# EasyEDA Pro project LeTian-robot2（轮腿机器人）.eprj, board Control-PCB
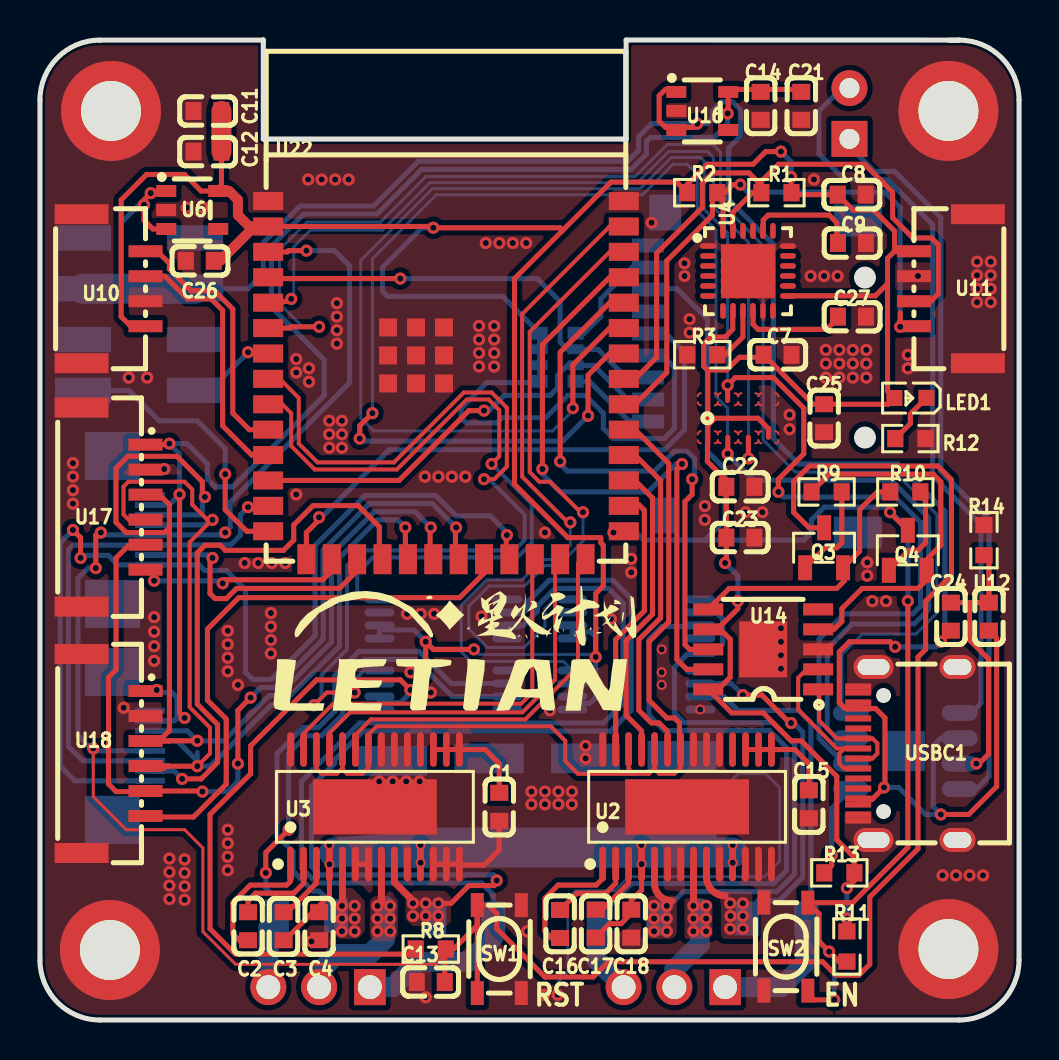
[diagram p4: board, top side]
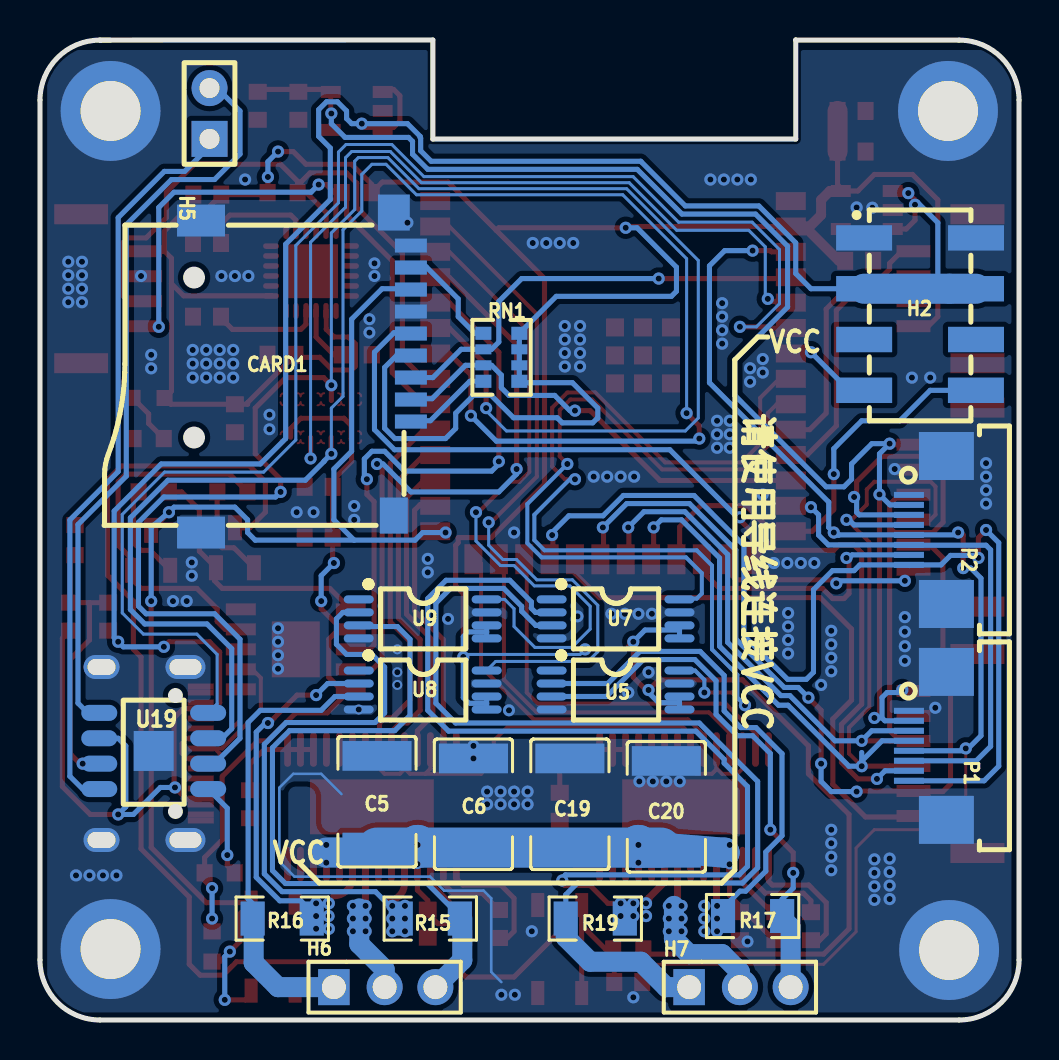
[diagram p5: board, bottom side, seen from below]

Outline 49 x 49.01 mm; copper layers: Top Layer, Bottom Layer. Coordinates in mm from the lower left corner of the outline.
Outline path: 46,49 29.34,49.01 29.34,44.05 11.18,44.05 11.18,49.01 11.17,49 3,49 arc(0.88,48.12) 0,46 0,3 arc(0.88,0.88) 3,0 46,0 arc(48.12,0.88) 49,3 49,46 arc(48.12,48.12) 46,49 ; 46,49 45.5,49
Stack: Top Layer 0.035mm / Dielectric1 1.51mm FR4 er 4.5 / Bottom Layer 0.035mm

## Design rules (mm)
spacing safeClearance (default): track to track 0.152, other pairs 0.05 to 0.3
track width trackWidth (default): min 0.127, default 0.254, max 2.54
differential pair differentialPair (default): width min 0.127, default 0.254, max 2.54; gap min 0.152, default 0.152
via viaSize (default): diameter min 0.3, default 0.61, max 10; hole min 0.2, default 0.305, max 6

## Placement (name value [footprint] x y rotation side)
C1  0.47uF  [C0603]  22.99 10.66 90 top
C2  10nF  [C0603]  10.41 4.69 270 top
C3  0.1uF  [C0603]  12.19 4.69 90 top
C4  0.1uF  [C0603]  13.97 4.69 90 top
C5  47uF  [C1812]  32.13 10.91 270 bottom
C6  47uF  [C1812]  27.31 10.79 270 bottom
C7  100nF  [C0603]  36.91 33.27 180 top
C8  100nF  [C0603]  40.62 41.27 180 top
C9  100nF  [C0603]  40.64 38.85 180 top
C11  0.1uF  [C0603]  8.38 45.46 180 top
C12  10uF  [C0603]  8.38 43.43 180 top
C13  0.1uF  [C0603]  19.56 1.9 0 top
C14  0.1uF  [C0603]  36.07 45.71 270 top
C15  0.47uF  [C0603]  38.48 10.79 90 top
C16  10nF  [C0603]  26.03 4.8 270 top
C17  0.1uF  [C0603]  27.81 4.82 90 top
C18  0.1uF  [C0603]  29.59 4.82 90 top
C19  47uF  [C1812]  22.48 10.79 270 bottom
C20  47uF  [C1812]  17.65 10.66 270 bottom
C21  10uF  [C0603]  38.1 45.71 270 top
C22  100nF  [C0603]  35.05 26.66 0 top
C23  1uF  [C0603]  35.05 24.12 0 top
C24  100nF  [C0603]  45.59 20.17 270 top
C25  100nF  [C0603]  39.24 30.09 270 top
C26  100nF  [C0603]  8 37.97 180 top
C27  100nF  [C0603]  40.64 35.17 180 top
CARD1  TF-15x15  [TF-SMD_TF-15-15]  35.69 32.38 0 bottom
H2  2.54-2*4P立贴针  [HDR-SMD_8P-P2.54-V-M-R2-C4-LS7.4]  4.95 35.3 270 bottom
H5  826629-2  [HDR-TH_2P-P2.54-V-M-1]  40.51 45.33 90 bottom
H6  2.54-1*3P针  [HDR-TH_3P-P2.54-V-M-1]  31.75 1.64 180 bottom
H7  2.54-1*3P针  [HDR-TH_3P-P2.54-V-M-1]  13.97 1.64 180 bottom
LED1  TLMS1100-GS08  [LED0603-RD_RED]  43.56 31.11 180 top
NOREF  -  [Pad_e5]  3.5 3.5 0 top
NOREF#2  -  [Pad_e2703]  3.56 45.46 0 top
NOREF#3  -  [Pad_e3]  45.47 3.55 0 top
NOREF#4  -  [Pad_e2704]  45.47 45.46 0 top
P1  FPC 0.5MM 8P 拉抽式 H2.0mm 下接  [FPC-SMD_8P-P0.50_LSXJ-H2.0-8P]  4.57 13.71 270 bottom
P2  FPC 0.5MM 8P 拉抽式 H2.0mm 下接  [FPC-SMD_8P-P0.50_LSXJ-H2.0-8P]  4.57 24.5 270 bottom
Q3  SS8050  [SOT-23-3_L2.9-W1.3-P1.90-LS2.4-BR]  39.24 23.61 270 top
Q4  SS8050  [SOT-23-3_L2.9-W1.3-P1.90-LS2.4-BR]  43.43 23.49 270 top
R1  10k  [R0603]  36.86 41.37 0 top
R2  10k  [R0603]  33.15 41.37 180 top
R3  10k  [R0603]  33.15 33.27 0 top
R8  10k  [R0603]  19.56 3.55 180 top
R9  10k  [R0603]  39.37 26.41 180 top
R10  10k  [R0603]  43.31 26.41 180 top
R11  10k  [R0603]  40.39 3.68 90 top
R12  1k  [R0603]  43.56 29.08 180 top
R13  1k  [R0603]  40 7.36 0 top
R14  0  [R0603]  47.24 24 90 top
R15  0Ω  [R1206]  29.46 5.07 0 bottom
R16  10mΩ  [R1206]  36.88 5.07 180 bottom
R17  10mΩ  [R1206]  13.34 5.2 0 bottom
R19  0Ω  [R1206]  21.21 5.07 180 bottom
RN1  1kΩ  [RES-ARRAY-SMD_0603-8P-L3.2-W1.6-BL]  25.91 33.14 270 bottom
SW1  -  [KEY-SMD_4P-L4.2-W3.2-P2.20-LS5.1-TL]  22.99 3.55 90 top
SW2  -  [KEY-SMD_4P-L4.2-W3.2-P2.20-LS5.1-TL]  37.33 3.67 90 top
U2  DRV8313PWPR  [HTSSOP-28_L9.8-W4.5-P0.65-LS6.6-BL-EP]  32.38 10.66 0 top
U3  DRV8313PWPR  [HTSSOP-28_L9.8-W4.5-P0.65-LS6.6-BL-EP]  16.76 10.66 0 top
U4  MPU6050  [QFN-24_L4.0-W4.0-P0.50-BL-EP2.7]  35.43 37.46 270 top
U5  INA240A3PWR  [TSSOP-8_L4.4-W3.0-P0.65-LS6.4-BL-2]  20.19 16.5 270 bottom
U6  SPX3819M5-L-3-3/TR  [SOT-23-5_L3.0-W1.7-P0.95-LS2.8-BR]  7.62 40.51 180 top
U7  INA240A3PWR  [TSSOP-8_L4.4-W3.0-P0.65-LS6.4-BL-2]  20.19 20.06 270 bottom
U8  INA240A3PWR  [TSSOP-8_L4.4-W3.0-P0.65-LS6.4-BL-2]  29.84 16.5 270 bottom
U9  INA240A3PWR  [TSSOP-8_L4.4-W3.0-P0.65-LS6.4-BL-2]  29.84 20.06 270 bottom
U10  GH1.25-4PWBPZ  [CONN-SMD_GH1.25-4PWBPZ]  3.68 36.57 90 top
U11  GH1.25-4PWBPZ  [CONN-SMD_GH1.25-4PWBPZ]  45.34 36.57 270 top
U12  10uF  [C0603]  47.49 20.17 270 top
U14  CH340K  [ESOP-10_L4.9-W3.9-P1.00-LS6.2-BL-EP]  36.19 18.53 90 top
U16  SPX3819M5-L-3-3/TR  [SOT-23-5_L3.0-W1.7-P0.95-LS2.8-BR]  33.15 45.46 180 top
U17  1.25-6PWTDK  [CONN-SMD_6P-P1.25_GH1.25-6PWBPZ]  3.68 25.65 270 top
U18  1.25-6PWTDK  [CONN-SMD_6P-P1.25_GH1.25-6PWBPZ]  3.68 13.33 270 top
U19  -  [NS4168-eSOP8]  43.31 13.45 0 bottom
U20  -  [MSM-MIC]  34.92 30.09 270 top
U22  ESP32-S3-WROOM-1-N8  [WIFIM-SMD_ESP32-S3-WROOM-1-N8]  20.32 32 0 top
USBC1  TYPE-C-31-M-12  [USB-C_SMD-TYPE-C-31-M-12]  43.43 13.33 90 top

## Footprints (pads in the part's own frame, mm; a bottom-side part is the same pattern mirrored in y, then rotated)
C0603
  rect 0.8x0.9 smd: 1(-0.7,0) 2(0.7,0)
C1812
  rect 1.486x3.457 smd: 1(-2.293,0) 2(2.293,0)
CONN-SMD_6P-P1.25_GH1.25-6PWBPZ
  rect 0.6x1.7 smd: 1(-3.125,1.6) 2(-1.875,1.6) 3(-0.625,1.6) 4(0.625,1.6) 5(1.875,1.6) 6(3.125,1.6)
  rect 1x2.7 smd: 7(-4.975,-1.6) 8(4.975,-1.6)
CONN-SMD_GH1.25-4PWBPZ
  rect 0.6x1.7 smd: 1(-1.875,-1.601) 2(-0.625,-1.601) 3(0.625,-1.601) 4(1.875,-1.601)
  rect 1x2.7 smd: 5(-3.725,1.601) 6(3.725,1.601)
ESOP-10_L4.9-W3.9-P1.00-LS6.2-BL-EP
  rect 0.6x1.5 smd: 1(-2,-2.75) 2(-1,-2.75) 3(0,-2.75) 4(1,-2.75) 5(2,-2.75) 6(2,2.75) 7(1,2.75) 8(0,2.75) 9(-1,2.75) 10(-2,2.75)
  rect 2.8x2.4 smd: 11(0,0)
FPC-SMD_8P-P0.50_LSXJ-H2.0-8P
  rect 0.3x1.5 smd: 1(-1.755,-0.938) 2(-1.255,-0.938) 3(-0.755,-0.938) 4(-0.255,-0.938) 5(0.244,-0.938) 6(0.745,-0.938) 7(1.244,-0.938) 8(1.745,-0.938)
  rect 2.4x2.75 smd: 9(3.7,0.938) 10(-3.7,0.938)
HDR-SMD_8P-P2.54-V-M-R2-C4-LS7.4
  rect 1.27x2.8 smd: 1(-3.81,-2.8) 2(-3.81,2.8) 3(-1.27,-2.8) 4(-1.27,2.8) 5(1.27,-2.8) 6(1.27,2.8) 7(3.81,-2.8) 8(3.81,2.794)
HDR-TH_2P-P2.54-V-M-1
  rect 1.8x1.8 hole 1: 1(-1.27,0)
  round 1.8 hole 1: 2(1.27,0)
HDR-TH_3P-P2.54-V-M-1
  rect 1.575x1.801 hole 1.199: 1(-2.54,0)
  round 1.801 hole 1.199: 2(0,0) 3(2.54,0)
HTSSOP-28_L9.8-W4.5-P0.65-LS6.6-BL-EP
  oval 0.343x1.732 smd: 1(-4.224,-2.865) 2(-3.574,-2.865) 3(-2.926,-2.865) 4(-2.276,-2.865) 5(-1.625,-2.865) 6(-0.976,-2.865) 7(-0.325,-2.865) 8(0.325,-2.865) 9(0.976,-2.865) 10(1.625,-2.865) 11(2.276,-2.865) 12(2.926,-2.865) 13(3.576,-2.865) 14(4.224,-2.865) 15(4.224,2.865) 16(3.576,2.865) 17(2.926,2.865) 18(2.276,2.865) 19(1.625,2.865) 20(0.976,2.865) 21(0.325,2.865) 22(-0.325,2.865) 23(-0.976,2.865) 24(-1.625,2.865) 25(-2.276,2.865) 26(-2.926,2.865) 27(-3.574,2.865) 28(-4.224,2.865)
  rect 6.2x2.751 smd: 29(0,0)
KEY-SMD_4P-L4.2-W3.2-P2.20-LS5.1-TL
  rect 1.199x0.65 smd: 1(-2.2,1.1) 2(2.2,1.1) 3(-2.2,-1.1) 4(2.2,-1.1)
LED0603-RD_RED
  rect 0.8x0.8 smd: 1(-0.799,-0.004) 2(0.799,0.004)
MSM-MIC
  custom 0.599x1.001 smd: 1(-0.95,1.532) 3(-0.95,-0.5) 6(0.95,-0.5) 8(0.95,1.532)
  custom 0.602x1.001 smd: 2(-0.95,0.531) 4(-0.95,-1.501) 5(0.95,-1.501) 7(0.95,0.531)
NS4168-eSOP8
  oval 1.8x0.8 smd: 1(-2.725,1.905) 2(-2.725,0.635) 3(-2.725,-0.635) 4(-2.725,-1.905) 5(2.725,-1.905) 6(2.725,-0.635) 7(2.725,0.635) 8(2.725,1.905)
  rect 2x2 smd: 9(0,0)
Pad_e3
  round 5 hole 3: 1(0,0)
Pad_e5
  round 5 hole 3: 2(0,0)
Pad_e2703
  round 5 hole 3: 2(0,0)
Pad_e2704
  round 5 hole 3: 2(0,0)
QFN-24_L4.0-W4.0-P0.50-BL-EP2.7
  oval 0.28x0.8 smd: 1(-1.25,-2) 2(-0.75,-2) 3(-0.25,-2) 4(0.25,-2) 5(0.75,-2) 6(1.25,-2) 13(1.25,2) 14(0.75,2) 15(0.25,2) 16(-0.25,2) 17(-0.75,2) 18(-1.242,2)
  oval 0.8x0.28 smd: 7(2,-1.25) 8(2,-0.75) 9(2,-0.25) 10(2,0.25) 11(2,0.75) 12(2,1.25) 19(-2,1.25) 20(-2,0.75) 21(-2,0.25) 22(-2,-0.25) 23(-2,-0.75) 24(-2,-1.25)
  rect 2.7x2.7 smd: 25(0.013,0)
R0603
  rect 0.806x0.864 smd: 1(-0.753,0) 2(0.753,0)
R1206
  rect 1.208x1.701 smd: 1(-1.479,0) 2(1.479,0)
RES-ARRAY-SMD_0603-8P-L3.2-W1.6-BL
  rect 0.65x0.8 smd: 1(-1.2,-0.9) 4(1.2,-0.9) 5(1.2,0.9) 8(-1.2,0.9)
  rect 0.5x0.8 smd: 2(-0.4,-0.9) 3(0.4,-0.9) 6(0.4,0.9) 7(-0.4,0.9)
SOT-23-3_L2.9-W1.3-P1.90-LS2.4-BR
  rect 1.25x0.7 smd: 1(1,-0.95) 2(1,0.95) 3(-1,0)
SOT-23-5_L3.0-W1.7-P0.95-LS2.8-BR
  rect 1x0.6 smd: 1(1.3,-0.95) 2(1.3,0) 3(1.3,0.95) 4(-1.3,0.95) 5(-1.3,-0.95)
TF-SMD_TF-15-15
  rect 1.6x0.701 smd: 1(-5.252,2.45) 2(-5.252,1.35) 3(-5.252,0.25) 4(-5.252,-0.85) 5(-5.252,-1.95) 6(-5.252,-3.05) 7(-5.252,-4.15) 8(-5.252,-5.25) 9(-5.252,-6.35)
  rect 1.6x1.8 smd: 10(-4.399,-8)
  rect 2.4x1.6 smd: 11(5.252,-7.6) 12(5.252,8)
  rect 1.399x1.801 smd: 13(-4.398,7.151)
TSSOP-8_L4.4-W3.0-P0.65-LS6.4-BL-2
  oval 0.4x1.5 smd: 1(-0.975,-3.2) 2(-0.325,-3.2) 3(0.325,-3.2) 4(0.976,-3.2) 5(0.976,3.2) 6(0.325,3.2) 7(-0.325,3.2) 8(-0.975,3.2)
USB-C_SMD-TYPE-C-31-M-12
  oval 1.2x2 hole 0.8x1.6: 0(-4.325,1.716) 1(4.325,1.716)
  oval 1.2x1.8 hole 0.8x1.4: 2(4.325,-2.484) 3(-4.325,-2.484)
  rect 0.3x1.3 smd: A1(-3.35,2.484) A4(-2.55,2.484) A5(-1.25,2.484) A6(-0.25,2.484) A7(0.25,2.484) A8(1.25,2.484) A9(2.55,2.484) A12(3.35,2.484) B1(3.05,2.484) B4(2.25,2.484) B5(1.75,2.484) B6(0.75,2.484) B7(-0.75,2.484) B8(-1.75,2.484) B9(-2.25,2.484) B12(-3.05,2.484)
WIFIM-SMD_ESP32-S3-WROOM-1-N8
  rect 1.5x0.9 smd: 1(-8.9,8.954) 2(-8.9,7.684) 3(-8.9,6.415) 4(-8.9,5.144) 5(-8.9,3.874) 6(-8.9,2.604) 7(-8.9,1.335) 8(-8.9,0.065) 9(-8.9,-1.206) 10(-8.9,-2.475) 11(-8.9,-3.745) 12(-8.9,-5.016) 13(-8.9,-6.285) 14(-8.9,-7.556) 27(8.9,-7.556) 28(8.9,-6.285) 29(8.9,-5.016) 30(8.9,-3.745) 31(8.9,-2.475) 32(8.9,-1.206) 33(8.9,0.065) 34(8.9,1.335) 35(8.9,2.604) 36(8.9,3.874) 37(8.9,5.144) 38(8.9,6.415) 39(8.9,7.684) 40(8.9,8.954)
  rect 0.9x1.5 smd: 15(-6.985,-8.954) 16(-5.715,-8.954) 17(-4.445,-8.954) 18(-3.175,-8.954) 19(-1.905,-8.954) 20(-0.635,-8.954) 21(0.635,-8.954) 22(1.905,-8.954) 23(3.175,-8.954) 24(4.445,-8.954) 25(5.715,-8.954) 26(6.985,-8.954)
  rect 0.9x0.9 smd: 41(-2.9,2.635) 41(-2.9,1.235) 41(-2.9,-0.165) 41(-1.5,2.635) 41(-1.5,1.235) 41(-1.5,-0.165) 41(-0.1,2.635) 41(-0.1,1.235) 41(-0.1,-0.165)

## Nets
As in the schematic, except:
GND: C1.1 C4.1 C5.1 C6.1 C7.1 C8.1 C9.1 C11.2 C12.2 C13.1 C14.2 C15.1 C18.1 C19.1 C20.1 C21.2 C22.2 C23.2 C25.2 C26.2 C27.1 CARD1.6 CARD1.9 CARD1.10 CARD1.11 CARD1.12 CARD1.13 H2.1 H2.2 NOREF.2 NOREF#2.2 NOREF#3.1 NOREF#4.2 P1.1 P1.9 P1.10 P2.1 P2.9 P2.10 R3.1 R12.1 R14.2 SW1.3 SW1.4 SW2.1 SW2.2 U2.6 U2.7 U2.10 U2.12 U2.13 U2.14 U2.19 U2.20 U2.21 U2.28 U2.29 U3.6 U3.7 U3.10 U3.12 U3.13 U3.14 U3.19 U3.20 U3.21 U3.28 U3.29 U4.1 U4.11 U4.18 U4.25 U5.4 U5.7 U6.2 U7.4 U7.7 U8.4 U8.7 U9.4 U9.7 U10.2 U10.5 U10.6 U11.2 U11.5 U11.6 U14.3 U14.11 U16.2 U17.2 U17.7 U17.8 U18.2 U18.7 U18.8 U19.9 U20.1 U22.1 U22.40 U22.41 USBC1.0 USBC1.1 USBC1.2 USBC1.3 USBC1.A1 USBC1.A12 USBC1.B1 USBC1.B12

Pads without a net: H2 5 6; U2 18; U3 18; U4 2 3 4 5 6 7 12 14 15 16 17 19 21 22; U5 1; U6 4; U7 1; U8 1; U9 1; U14 5; U16 4; U20 2; USBC1 A5 A8 B5 B8

## Via types
v1: diameter 0.61, hole 0.305, Top Layer to Bottom Layer, 261 vias
v2: diameter 0.6, hole 0.305, Top Layer to Bottom Layer, 15 vias
v3: diameter 0.5, hole 0.305, Top Layer to Bottom Layer, 12 vias

## Routing (per net, layer and track width the routed paths; a pad name or vN(x,y) marks a point on that pad's centre or on a via; arc(x,y) is an arc through that point)
3.3V: length 71.6
  Top Layer w0.254: v1(34.42,45.33) 34.45,45.36 34.45,46.54 37.98,46.54 C21.1 ; v1(6.98,26.28) 6.98,15.36 v1(7.24,15.11) ; v1(6.48,28.82) 6.43,28.77 U17.1
  Bottom Layer w0.254: 6.86,15.11 v1(7.24,15.11) ; 6.86,15.11 6.86,16.12 6.6,16.38 5.97,16.38 v1(5.84,16.5) ; 6.86,15.11 6.72,14.96 P1.2 ; P2.2 6.46,25.76 v1(6.98,26.28) 6.98,28.31 v1(6.48,28.82) 7.37,28.82 8.38,27.81 8.38,27.04 8.76,26.66 9.65,26.66 14.22,31.23 14.22,33.01 11.58,35.65 11.58,38.7 13.19,40.3 16.87,40.3 19.1,42.54 29.59,42.54 30.35,43.3 30.35,43.93 30.55,44.14 33.73,44.14 34.42,44.82 v1(34.42,45.33)
3V3: length 246.7
  Top Layer w0.254: 19.56,39.74 19.5,39.68 U22.2 ; U10.1 4.54,34.69 4.06,35.17 4.06,41.01 5.33,42.28 7.24,42.28 8.07,41.45 8.78,41.45 9.08,41.76 C12.1 ; 42.83,38.44 U11.1 ; 42.83,38.44 42.77,38.5 42.77,39.45 41.72,40.51 40.69,40.51 C8.2 37.71,41.27 37.59,41.39 v1(37.59,42.16) ; 42.83,38.44 42.77,38.44 42.42,38.09 42.42,36.82 ; 33.42,29.73 33.78,30.09 35.94,30.09 36.46,29.58 U20.8 ; 33.42,29.73 33.42,32.48 33.4,32.5 ; 33.42,29.73 33.42,29.08 33.4,27.93 34.35,26.98 C22.1 C23.1 34.35,22.91 v1(34.29,22.85) ; v1(40.39,6.6) 40.76,6.97 R13.2 40.76,8.13 39.88,9.01 39.88,12.18 38.1,13.96 37.59,13.96 36.19,15.36 34.62,15.36 U14.10 33.94,16.53 34.54,17.14 34.54,19.04 34.05,19.53 33.89,19.53 ; 33.4,32.5 33.22,32.69 33.22,33.81 33.56,34.16 34.29,34.16 34.67,34.54 34.67,35.48 ; 33.4,32.5 34.37,32.5 35,33.14 36.09,33.14 C7.2 38.61,30.87 38.61,30.79 C25.1 42.45,30.79 LED1.2 42.42,31.45 42.42,36.82 ; 42.42,36.82 41.81,36.21 37.41,36.21 ; v1(19.69,39.62) 26.03,39.62 26.16,39.49 ; U14.7 33.89,19.53 ; 33.89,19.53 34.92,20.57 v1(34.92,20.95) ; R8.2 18.55,3.29 9.78,3.29 8.51,4.56 8.51,10.28 10.54,12.31 10.54,13.71 13.84,17.01 18.03,17.01 v1(18.54,16.5) ; 26.16,39.49 23.75,37.08 23.75,26.79 26.42,24.12 28.07,24.12 28.07,23.87 28.19,23.74 28.19,21.71 27.81,21.33 v1(27.81,18.15) ; 26.16,39.49 28.57,41.9 31.86,41.9 R2.2 32.39,41.78 33.4,42.79 35.69,42.79 36.32,43.43 v1(37.08,43.43) ; v1(21.72,18.53) 19.69,18.53 v1(19.3,18.92) 19.3,17.14 18.54,16.38 ; R11.2 v1(40.39,5.07)
  Top Layer w0.5: 10.73,39.68 10.48,39.68 9.91,40.25 9.91,41.01 9.46,41.45 U6.5 ; 10.73,39.68 11.26,39.68 ; 10.73,39.68 9.02,37.97 C26.1
  Top Layer w1: C11.1 C12.1
  Bottom Layer w0.15: v1(27.81,18.15) 27.67,18.28 21.97,18.28 v1(21.72,18.53)
  Bottom Layer w0.254: 30.31,33.27 31.11,33.27 31.75,32.63 31.75,29.59 31.24,29.08 28.7,29.08 28.19,29.58 28.19,30.34 27.31,31.23 26.42,31.23 25.3,30.12 23.11,30.12 22.86,29.86 21.34,29.86 21.11,30.09 21.08,30.09 21.08,30.6 22.35,31.87 24.94,31.87 25.01,31.94 25.01,34.34 23.16,36.19 17.4,36.19 17.15,36.44 17.15,37.64 19.12,39.62 v1(19.69,39.62) ; U8.5 26.64,15.84 ; 26.64,15.84 U8.6 ; 26.64,15.84 27.53,15.84 27.81,16.12 v1(27.81,18.15) 27.81,19.17 27.58,19.4 26.64,19.4 ; v1(19.3,18.92) 18.72,19.5 16.99,19.5 ; v1(18.54,16.5) 18.54,16.38 18.03,15.87 17.06,15.87 16.99,15.8 ; 16.99,19.5 U7.5 ; 16.99,19.5 U7.6 ; v1(34.92,20.95) 34.92,22.22 v1(34.29,22.85) ; v1(37.08,43.43) 37.59,42.92 v1(37.59,42.16) ; U9.5 26.64,19.4 ; 26.64,19.4 U9.6 ; 16.99,15.8 U5.6 ; 16.99,15.8 U5.5 ; v1(40.39,6.6) v1(40.39,5.07)
5V: length 122.6
  Top Layer w0.254: U6.3 5.65,39.56 5.21,40 v1(5.21,40.77) 5.21,41.01 5.65,41.45 U6.1 ; v1(32.89,44.82) 32.7,44.64 31.3,44.64 30.99,44.95 30.99,46.22 31.3,46.54 31.85,46.54 ; U12.2 47.88,19.08 47.88,11.68 46.48,10.28 v1(45.09,10.28) ; USBC1.A4 41.21,11.04 41.66,11.04 v1(42.24,11.63) 42.29,11.67 42.29,15.11 41.82,15.58 USBC1.B4 ; v1(42.8,18.66) 42.54,18.92 40.51,18.92 40,18.41 40,15.87 40.26,15.61 40.91,15.61 USBC1.B4 ; USBC1.B4 USBC1.A9 ; v1(45.09,18.92) 45.59,19.42 C24.2
  Bottom Layer w0.254: 18.91,42.92 18.94,42.94 29.42,42.94 29.95,43.47 29.95,44.1 29.97,44.13 29.97,44.19 30.61,44.82 v1(32.89,44.82) 33.4,44.82 33.66,45.08 33.66,45.46 34.11,45.92 34.66,45.92 35.05,45.52 35.05,44.19 34.47,43.6 34.47,41.03 36.7,38.79 36.7,29.08 37.97,27.81 42.93,27.81 45.29,25.45 45.29,19.12 v1(45.09,18.92) 44.83,18.66 v1(42.8,18.66) ; v1(5.21,40.77) 5.08,40.89 4.06,39.87 4.06,37.16 3.47,36.57 ; 18.91,42.92 16.7,40.71 13.02,40.71 11.18,38.86 11.18,37.33 10.41,36.57 H2.3 ; U19.6 45.09,14.09 44.7,13.71 44.7,10.66 v1(45.09,10.28) 44.32,10.28 42.97,11.63 v1(42.24,11.63)
  Bottom Layer w1.5: H2.3 H2.4
  vias: v1(5.54,41.35)
AGND: length 14
  Top Layer w0.254: C24.1 46.52,20.87 ; 46.52,20.87 U12.1 47.49,22.99 R14.1 ; 46.52,20.87 46.52,19 47.47,18.05 47.47,13.3 46.99,12.82 v1(46.86,12.82)
  Bottom Layer w0.254: U19.7 v1(46.86,12.82)
GND: length 29
  Top Layer w0.254: U3.6 U3.7 ; C1.1 22.99,8.5 22.22,7.74 21.04,7.74 U3.14 U3.13 U3.12
  Bottom Layer w0.13: 33.91,11.3 34.92,12.31 36.32,12.31 37.02,11.61 37.02,7.93 36.26,7.17 29.47,7.17 28.77,6.47 26.8,6.47 26.42,6.09 26.42,2.41 25.91,1.9
  vias: v1(1.65,27.84) v1(1.65,27.17) v1(1.65,26.5) v1(1.65,25.82) v1(4.19,15.61) v1(4.44,32.12) v1(5.36,32.12) v1(5.72,20.15) v1(5.72,19.42) v1(5.72,18.69) v1(5.72,17.96) v1(6.22,27.55) v1(6.48,8.07) v1(6.48,7.4) v1(6.48,6.72) v1(6.48,6.05) v1(7.24,8.03) v1(7.24,7.36) v1(7.24,6.68) v1(7.24,6.01) v1(7.34,40.62) v1(8.13,40.63) v1(9.4,19.46) v1(9.4,18.79) v1(9.4,18.11) v1(9.4,17.44) v1(9.4,9.51) v1(9.4,8.84) v1(9.4,8.16) v1(9.4,7.49) v1(9.91,16.76) v1(10.25,22.85) v1(10.92,22.85) v1(11.6,22.85) v1(11.56,20.35) v1(11.56,19.68) v1(11.56,19) v1(11.56,18.33) v1(12.27,22.85) v1(12.83,33.05) v1(12.83,32.38) v1(12.83,26.28) v1(13.42,42.03) v1(13.46,32.59) v1(13.46,31.92) v1(14.1,42.03) v1(14.48,29.96) v1(14.48,29.29) v1(14.48,28.61) v1(14.77,42.03) v1(14.86,35.85) v1(14.86,35.17) v1(14.86,34.5) v1(14.86,33.82) v1(15.11,29.96) v1(15.11,29.29) v1(15.11,28.61) v1(15.45,42.03) v1(16.98,11.93) v1(17.65,11.93) v1(18.38,20.31) v1(18.33,11.93) v1(18.54,17.39) v1(19,11.93) v1(19.05,20.31) v1(19.26,27.17) v1(19.3,1.14) v1(19.56,16.38) v1(19.72,20.31) v1(19.94,27.17) v1(20.4,20.31) v1(20.61,27.17) v1(21.29,27.17) v1(21.97,34.7) v1(21.97,34.03) v1(21.97,33.35) v1(21.97,32.68) v1(22.31,38.85) v1(22.73,34.7) v1(22.73,34.03) v1(22.73,33.35) v1(22.73,32.68) v1(22.99,38.85) v1(23.66,38.85) v1(24.34,38.85) v1(24.38,4.44) v1(24.6,11.42) v1(24.6,10.79) v1(25.27,24.38) v1(25.27,11.42) v1(25.27,10.79) v1(25.23,1.26) v1(25.91,1.26) v1(25.95,11.42) v1(25.95,10.79) v1(26.62,11.42) v1(26.62,10.79) v1(29.59,23.06) v1(29.59,22.38) v1(33.27,25.7) v1(33.27,25.01) v1(37.08,19.59) v1(37.08,18.92) v1(37.08,18.24) v1(37.08,17.57) v1(38.57,37.2) v1(38.73,42.03) v1(39.24,37.2) v1(39.33,33.51) v1(39.33,32.82) v1(39.33,32.12) v1(39.92,37.2) v1(40,33.51) v1(40,32.82) v1(40,32.12) v1(40.68,33.51) v1(40.68,32.82) v1(40.68,32.12) v1(41.35,33.51) v1(41.35,32.82) v1(41.35,32.12) v1(41.4,22.88) v1(41.4,22.22) v1(41.66,20.95) v1(42.34,20.95) v1(43.43,33.26) v1(43.43,32.59) v1(43.94,37.2) v1(45.17,7.23) v1(45.85,7.23) v1(46.52,7.23) v1(46.9,37.92) v1(46.9,37.24) v1(46.9,36.57) v1(46.9,35.89) v1(47.2,7.23) v1(47.58,37.92) v1(47.58,37.24) v1(47.58,36.57) v1(47.58,35.89) v2(13.59,3.93) v2(22.1,20.19) v2(25.53,15.49) v2(27.31,13.71) v2(27.31,13.08) v2(28.57,20.06) v2(30.61,39.87) v2(32.26,37.84) v2(32.26,37.2) v2(32.51,35.04) v2(32.51,34.37) v2(35.31,25.39) v2(36.15,25.39) v2(37.51,30.27) v2(37.51,29.54) v3(31.12,18.53) v3(31.12,17.39) v3(31.12,16.76) v3(33.05,15.53)
V0-I: length 50.2
  Top Layer w0.254: v1(22.86,6.98) 22.86,6.85 22.73,6.72 21.46,6.72 20.57,5.83 v1(19.94,5.83)
  Top Layer w0.35: v1(18.67,5.83) 18.54,5.83 18.54,6.09 17.74,6.89 U3.9
  Bottom Layer w0.254: U7.2 24.2,20.38 24.41,20.59 24.41,20.91 25.49,21.99 28.68,21.99 29.59,21.07 29.59,15.49 28.55,14.44 16.17,14.44 14.76,13.03 14.76,12.84 13.59,11.68 13.59,7.68 14.01,7.26 22.71,7.26 22.86,7.1 v1(22.86,6.98)
  vias: v1(18.67,5.2) v1(19.3,5.83) v1(19.3,5.2) v1(19.94,5.2)
V0-O: length 53.5
  Bottom Layer w0.254: U7.3 24.19,19.73 24.89,20.44 24.89,20.69 25.79,21.58 28.45,21.58 29.18,20.85 29.18,15.84 28.19,14.85 16,14.85 13.08,11.93 13.08,7.61 13.84,6.85 22.1,6.85 22.68,6.27 22.68,5.07
  Bottom Layer w1: H7.1 17.65,1.64 18.92,2.91 21.46,2.91 22.68,4.13 22.68,5.07
V1-I: length 30.2
  Top Layer w0.35: U2.5 30.76,6.82 arc(31.01,6.21) 31.62,5.96
  Bottom Layer w0.254: U9.2 33.84,20.38 34.16,20.06 34.16,18.79 33.66,18.28 32.38,18.28 31.75,17.65 31.75,15.36 32.23,14.88 36.68,14.88 37.77,13.78 37.77,7.31 36.88,6.42 32.21,6.42 31.5,5.71 v1(31.37,5.71)
  vias: v1(30.73,5.71) v1(30.73,5.07) v1(30.73,4.44) v1(31.37,5.07) v1(31.37,4.44)
V1-O: length 34.7
  Bottom Layer w0.254: U9.3 32.99,19.68 31.12,19.68 30.48,19.04 30.48,15.23 31.24,14.47 36.51,14.47 37.36,13.62 37.36,7.48 36.71,6.82 29.62,6.82 27.99,5.2
  Bottom Layer w1: 27.86,5.07 27.86,2.99 H6.3
VCC: length 30.4
  Top Layer w0.254: C17.1 28.51,4.82 29.08,4.82 29.59,5.33 29.59,5.98 30.11,6.5 v3(30.11,7.8) ; 14.48,8.25 14.49,8.24 v3(14.49,7.79) 14.49,6.23 12.25,3.99
  Bottom Layer w1.5: 14.73,8.37 14.74,8.37 17.91,8.62 ; 34.67,8.37 32.38,8.37 C5.2
  Bottom Layer w2: 17.91,8.62 18.92,8.62 v3(19.05,8.76) 19.18,8.62 29.96,8.62 v3(30.1,8.76) 30.23,8.62 C5.2
  vias: v3(14.48,8.76) v3(19.05,7.87) v3(34.67,8.76) v3(34.67,7.87)
BLK: length 53.4
  Top Layer w0.254: 23.34,23.04 23.34,24.22 v1(23.37,24.25) ; v1(2.03,23.11) 2.03,24.12 v1(1.65,24.5)
  Bottom Layer w0.254: 5.48,22.73 P2.8 ; P2.8 3.9,22.76 3.43,23.23 2.29,23.23 2.16,23.11 v1(2.03,23.11) ; P2.8 7.97,22.76 8.25,22.47 9.34,22.47 10.29,21.52 10.29,17.39 10.64,17.04 11.58,17.04 13.77,19.22 13.77,23.73 16.27,26.23 19.8,26.23 20.82,25.21 22.53,25.21 23.37,24.38 v1(23.37,24.25) ; v1(1.65,24.5) 1.02,23.87 1.02,12.69 1.74,11.96 P1.8
CS0: length 27.6
  Top Layer w0.254: v1(7.11,12.06) 8.06,12.06 8.89,12.88 8.89,14.78 7.87,15.79 7.87,23.36 8.25,23.74 9.02,23.74 9.27,23.49 12.19,23.49 12.7,24 12.7,24.76 13.66,25.72 15.93,25.72 16.98,24.66 16.98,23.04
  Bottom Layer w0.254: v1(7.11,12.06) 6.71,12.46 P1.7
CS1: length 13.6
  Top Layer w0.254: 15.72,23.04 15.72,22.31 14.99,21.58 9.84,21.58 9.33,21.07 8.76,21.07 8.51,21.33 8.51,22.98 v1(8.64,23.11)
  Bottom Layer w0.254: v1(8.64,23.11) 8.51,23.11 8.36,23.26 P2.7
CS2: length 10.8
  Top Layer w0.254: 5.03,22.48 5.45,22.48 5.72,22.22 v1(5.72,21.96) ; v1(9.14,21.84) 9.14,21.96 9.19,22.01 14.15,22.01 14.44,22.31 14.44,23.04
  Bottom Layer w0.254: v1(9.14,21.84) 9.02,21.96 v1(5.72,21.96)
CS3: length 29.2
  Top Layer w0.254: 5.03,10.2 5.08,10.15 7.68,10.15 9.32,11.79 9.32,15.05 8.38,15.99 8.38,19.55 9.95,21.12 ; 22.35,23.33 22.35,23.17 U22.22 22.22,22.34 21,21.12 9.95,21.12
DATA1: length 5.4
  Bottom Layer w0.254: RN1.1 27.23,34.34 28.07,35.17 28.07,36.06 29.67,37.67 30.31,37.67
DATA2: length 4.3
  Bottom Layer w0.254: 30.31,29.97 29.46,29.97 27.49,31.94 RN1.4
DC: length 25.5
  Top Layer w0.254: v1(10.41,25.65) 11.2,25.65
  Bottom Layer w0.254: v1(10.41,25.65) 10.03,25.27 10.03,24.25 9.54,23.76 P2.6 5.49,23.74 1.65,23.74 1.42,23.51 1.42,13.68 2.14,12.96 P1.6
DTR: length 19.2
  Top Layer w0.254: U14.4 39.73,19.53 40.13,19.93 40.13,20.57 41.15,21.58 43.94,21.58 44.38,22.02 Q4.2 44.45,22.42 44.45,23.11 45.09,23.74 45.09,26.92 44.7,27.3 39.51,27.3 R9.2
EN: length 137.4
  Top Layer w0.15: 20.26,3.23 19.81,2.79 9.79,2.79 8.16,4.42 8.16,8.6 7.24,9.52 4.32,9.52 2.67,11.17 2.67,13.45
  Top Layer w0.254: 21.89,5.74 21.88,5.74 21.88,4.73 20.7,3.55 R8.1 20.26,3.49 20.26,1.77 ; 21.89,5.74 22.44,5.74 22.86,5.33 22.86,4.56 25.27,2.15 27.69,2.15 28.45,2.91 39.16,2.91 39.84,2.24 40.98,2.24 41.53,2.79 41.53,6.15 43.94,8.56 43.94,18.15 44.32,18.53 44.32,20.95 45.62,22.24 45.62,27.02 44.93,27.7 38.51,27.7 37.72,26.92 37.72,25.39 38.5,24.61 Q3.3 ; 21.89,5.74 SW1.1 ; 21.89,5.74 SW1.2 ; v1(3.05,24.38) 2.92,24.38 2.79,24.25 v1(2.79,22.6) ; 11.26,38.41 12.38,38.41 12.45,38.47 v1(13.34,38.47)
  Bottom Layer w0.254: 2.92,24.25 v1(3.05,24.38) ; v1(2.79,22.6) 2.41,22.6 1.91,22.09 1.91,14.22 2.66,13.46 P1.5 ; v1(13.34,38.47) 14.73,38.47 15.49,37.71 15.49,31.87 9.53,25.9 9.53,24.63 9.14,24.25 9.02,24.25 9.01,24.26 P2.5 2.93,24.26
  vias: v1(2.67,13.58) v1(9.27,24.38)
GPIO0/SD_MISO: length 64.3
  Top Layer w0.254: 28.64,24.44 28.57,24.44 28.57,24.5 28.64,24.44 ; 28.64,24.44 U22.27 ; 28.64,24.44 v1(28.7,24.38) ; v1(43.43,20.95) 43.43,8.63 40.67,5.87 SW2.4 38.99,5.31 38.99,3.93 v1(39.5,3.42) 40,2.91 40.38,2.91 R11.1 ; SW2.3 38.43,1.31 38.73,1.01 v1(39.75,1.01) ; Q4.3 42.54,25.38 v1(42.54,25.39)
  Bottom Layer w0.254: v1(39.5,3.42) 39.75,3.17 v1(39.75,1.01) ; 33.27,24 30.23,24 29.84,24.38 v1(28.7,24.38) ; 33.27,24 38.23,24 38.61,24.38 38.61,25.01 39.24,25.65 42.29,25.65 v1(42.54,25.39) 43.43,24.63 v1(43.43,20.95) ; 33.27,24 34.29,25.01 34.29,27.55 33.4,28.44 33.4,35.04 31.88,36.57 30.31,36.57
I2S_SCK: length 86.5
  Top Layer w0.254: U20.6 34.42,28.32 v1(34.42,28.31) ; v1(16,29.08) 16,29.08 16,29.71 v1(16.64,30.34) ; v1(27.43,30.22) 27.43,32.25 28.51,33.33 29.06,33.33
  Bottom Layer w0.15: v1(34.42,28.31) 34.42,30.6 33.83,31.18 33.83,39.51 32.89,40.45 32.89,42.28 32.38,42.79 31.68,42.79 30.16,41.27 19.83,41.27 16.64,38.07 v1(16.64,30.34)
  Bottom Layer w0.254: v1(34.42,28.31) 34.78,27.95 34.78,27.93 35.72,26.99 42.6,26.99 44.47,25.11 44.47,20.53 43.75,19.8 40.64,19.8 39.4,18.57 39.4,14.56 39.88,14.09 U19.3 ; 16,29.08 16.13,28.95 26.16,28.95 v1(27.43,30.22)
I2S_WS: length 90.6
  Top Layer w0.254: v1(26.67,30.6) 26.67,32.76 28.51,34.6 29.06,34.6 ; v1(36.96,26.41) 36.96,27.04 38.23,28.31 38.23,30.6 36.7,32.12 34.8,32.12 v1(34.42,31.74) 34.42,30.98
  Bottom Layer w0.15: v1(26.67,30.6) 26.67,30.47 25.65,29.46 16.7,29.46 16.05,30.1 16.05,37.98 19.64,41.57 30.03,41.57 31.59,43.13 33.07,43.13 33.25,42.94 33.25,40.53 34.42,39.36 ; 34.42,39.36 v1(34.42,31.74)
  Bottom Layer w0.254: v1(36.96,26.41) 37.21,26.15 42.8,26.15 44.07,24.88 44.07,20.69 43.69,20.31 40.26,20.31 38.99,19.04 38.99,14.09 40.26,12.82 U19.2
ISEN_U0: length 46.9
  Top Layer w0.2: v1(22.22,27.04) 22.73,27.04 23.37,27.68 23.37,30.61 22.6,31.38 21.21,31.38 17.71,27.88 13.89,27.88 12.95,28.82 12.95,31.11 12,32.06 11.26,32.06 ; v1(13.72,15.74) 14.35,16.38 v1(15.75,16.38)
  Bottom Layer w0.2: v1(22.22,27.04) 22.35,27.17 24.26,25.27 24.26,24 23.75,23.49 16.13,23.49 15.37,22.73 15.37,18.53 14.1,17.26 14.1,16.12 v1(13.72,15.74) ; v1(15.75,16.38) 15.75,17.01 16.22,17.48 U5.8
ISEN_U1: length 34.4
  Top Layer w0.2: 29.06,39.68 28.51,39.68 24.13,35.3 24.13,27.17 26.54,24.76
  Bottom Layer w0.15: v1(26.54,24.88) 26.54,23.74 25.83,23.03 25.15,23.03 24.13,22.01 22.35,22.01 21.08,20.74 21.08,18.42 21.57,17.93 26.19,17.93 U8.8
ISEN_V0: length 35
  Top Layer w0.2: v1(22.61,27.81) 22.99,28.19 22.99,30.5 22.46,31.03 21.36,31.03 17.86,27.53 13.75,27.53 12.57,28.7 12.57,30.34 12.13,30.79 11.26,30.79
  Bottom Layer w0.2: U7.8 16.95,21.07 16.13,21.07 15.88,21.33 15.88,22.34 16.67,23.13 23.9,23.13 24.61,23.85 24.61,25.8 v1(22.61,27.81)
ISEN_V1: length 33.7
  Top Layer w0.2: 27.18,25.27 25.53,26.92 24.99,26.92 24.51,27.4 24.51,34.41 28.51,38.41 29.06,38.41
  Bottom Layer w0.15: U9.8 25.74,21.03 25.27,20.57 25.27,19.68 24.23,18.63 22.38,18.63 21.46,19.55 21.46,20.69 22.48,21.71 24.26,21.71 25.27,22.73 25.95,22.73 27.18,23.95 v1(27.18,25.39)
  Bottom Layer w0.2: v1(27.18,25.39) 27.05,25.52
LCD-CLK: length 55.1
  Top Layer w0.254: 5.03,13.95 5.96,13.95 ; 5.96,13.95 6.47,13.95 6.48,13.96 v1(7.87,13.96) ; 5.96,13.95 6.48,14.47 6.48,24.63 ; 6.48,24.63 6.48,25.77 6.02,26.23 5.03,26.23 ; 6.48,24.63 6.22,24.38 4.32,24.38 3.8,24.89 3.8,27.58 4.4,28.19 6.86,28.19 8.13,26.92 8.13,26.28 v1(8.25,26.15) ; v1(19.56,24.63) 19.53,24.6 19.53,23.04
  Bottom Layer w0.254: P2.3 7.99,25.26 8.13,25.39 8.13,26.03 v1(8.25,26.15) ; P1.3 7.37,14.46 v1(7.87,13.96) 9.21,13.96 11.47,16.22 11.92,16.22 14.58,18.89 14.58,23.28 16.72,25.42 18.77,25.42 v1(19.56,24.63)
LCD-MISO: length 43
  Top Layer w0.254: v1(9.91,12.82) 9.91,15.49 v1(10.54,16.12) ; v1(8.13,11.42) 8.1,11.45 U18.5 ; v1(20.83,24.63) 20.79,24.6 20.79,23.04 ; 5.03,11.45 5,11.42 3.81,11.42 3.43,11.8 3.43,17.14 3.81,17.52 3.81,23.11 4.43,23.73 5.03,23.73
  Bottom Layer w0.254: v1(10.54,16.12) 11.05,16.63 11.75,16.63 14.18,19.05 14.18,23.51 16.49,25.82 19.63,25.82 v1(20.83,24.63) ; v1(9.91,12.82) 9.91,11.93 9.4,11.42 v1(8.13,11.42)
LCD-MOSI: length 51.2
  Top Layer w0.2: 8.61,25.01 8.38,25.01 7.62,25.77 7.62,26.54 7.24,26.92 4.42,26.92 4.18,26.68 4.18,25.28 4.48,24.98 5.03,24.98 ; 8.61,25.01 7.49,23.89 7.49,15.64 8.51,14.62 8.51,13.33 v1(7.87,12.69) ; 8.61,25.01 v1(8.64,25.01) ; 5.03,12.7 U18.4 ; 6.22,12.57 6.36,12.7
  Top Layer w0.254: v1(7.87,12.69) 6.48,12.69 6.47,12.7 U18.4 ; 18.25,23.04 18.29,23.07 v1(18.29,24.63)
  Bottom Layer w0.254: 7.87,12.95 v1(7.87,12.69) 8.51,12.69 11.56,15.74 12.04,15.74 14.99,18.69 14.99,23.11 16.89,25.01 17.91,25.01 v1(18.29,24.63) ; 7.87,12.95 6.86,13.96 P1.4 ; 7.87,12.95 7.87,13.38 ; v1(8.64,25.01) 8.51,25.01 8.26,24.76 P2.4
M0PWM1: length 19.8
  Top Layer w0.2: 24.6,23.04 24.64,23.01 24.64,16.38 24.08,15.82 14.68,15.82 13.19,14.33 U3.27
M0PWM2: length 19.3
  Top Layer w0.2: 25.88,23.04 25.78,22.95 25.78,17.02 24.15,15.39 15.52,15.39 14.49,14.35 U3.25
M0PWM3: length 18.7
  Top Layer w0.2: U3.23 15.79,14.26 16.57,15.03 24.29,15.03 26.92,17.67 26.92,22.82 27.15,23.04
M1PWM1: length 13.9
  Top Layer w0.254: 29.06,25.71 29.12,25.77 29.97,25.77 30.25,25.5 30.25,20.46 28.81,19.02 U2.27
M1PWM2: length 15.5
  Top Layer w0.254: U2.25 30.11,14.46 29.34,15.23 29.34,18.98 30.66,20.29 30.66,26.11 29.72,27.04 29.12,27.04 29.06,26.98
M1PWM3: length 17.2
  Top Layer w0.254: U2.23 31.41,14.43 30.99,14.85 30.61,14.85 29.97,15.49 29.97,19.02 31.06,20.11 31.06,26.97 29.78,28.25 29.06,28.25
M_EN: length 46.3
  Top Layer w0.2: U2.22 32.06,12.62 31.75,12.31 30.99,12.31 30.76,12.54 30.76,12.59 ; 29.72,12.31 26.92,12.31 26.29,12.95 26.29,13.96 25.57,14.68 16.85,14.68 16.44,14.27 U3.22 16.44,12.62 16.13,12.31 15.37,12.31 15.14,12.54 15.14,12.59 ; 29.72,12.31 29.46,12.57 U2.26 ; 29.72,12.31 30.48,12.31 30.76,12.59 ; 13.84,13.53 13.84,13.52 13.84,12.57 14.1,12.31 14.86,12.31 15.14,12.59 ; U3.24 15.14,12.59 ; U2.24 30.76,12.59
  Top Layer w0.254: 29.06,29.52 29.78,29.52 31.47,27.83 31.47,19.9 30.48,18.92 30.48,15.99 31.37,15.11 31.75,15.11 32,14.85 32,13.58 U2.22
MIC_DATA: length 44.1
  Top Layer w0.254: 12.19,35.93 12.45,35.93 v1(12.57,36.06) ; 12.19,35.93 11.26,35.93 ; 12.19,35.93 12.13,35.87 ; 35.43,28.06 v1(35.46,28.08) U20.7
  Bottom Layer w0.15: 35.46,38.89 33.71,40.64 33.71,43.12 33.4,43.43 31.46,43.43 29.91,41.87 19.51,41.87 17.13,39.49 13.53,39.49 12.7,38.66 12.7,36.19 v1(12.57,36.06) ; v1(35.46,28.08) 35.46,38.89
REGOUT: length 5.3
  Top Layer w0.254: C27.2 39.94,35.11 39.37,34.54 35.94,34.54 35.69,34.79 35.69,35.48
RTS: length 13.5
  Top Layer w0.254: 42.81,26.41 41.91,26.41 41.02,25.52 41.02,23.44 Q3.2 40.26,22.55 40.26,21.96 39.88,21.58 34.49,21.58 U14.6
RX0: length 27.8
  Top Layer w0.254: 29.06,35.87 28.51,35.87 26.03,33.39 v1(26.03,27.93) ; U14.8 32.51,18.53 32.28,18.77 32.28,25.92 32.64,26.28 v1(32.64,27.04)
  Bottom Layer w0.254: v1(32.64,27.04) 32.77,27.17 32.77,28.06 32.38,28.44 31.75,28.44 30.76,27.45 26.39,27.45 26.03,27.81 v1(26.03,27.93)
SCL0: length 13.3
  Top Layer w0.254: 5.03,37.19 6.25,37.19 7.39,36.06 8.57,36.06 9.14,35.49 9.14,29.71 10.6,28.25 11.26,28.25
SCL1: length 34.4
  Top Layer w0.254: 29.06,32.06 29.78,32.06 30.86,33.14 30.86,38.35 33.15,40.63 33.15,41.85 33.66,42.36 35.48,42.36 35.94,41.9 35.94,41.37 ; 35.94,41.37 35.67,41.37 34.67,40.38 34.67,39.44 ; 35.94,41.37 R1.1 36.1,41.94 36.96,42.79 41.28,42.79 42.67,41.39 42.67,40.12 43.69,39.11 44.62,39.11 44.96,38.77 44.96,36.31 44.59,35.94 U11.3
SD_CLK: length 28.8
  Top Layer w0.254: 13.17,23.04 13.34,23.2 13.34,24.38 13.97,25.01 v1(13.97,25.14)
  Bottom Layer w0.254: v1(13.97,25.14) 14.1,25.14 17.47,28.52 31.25,28.52 32.26,29.52 32.26,33.39 31.28,34.37 30.31,34.37
SD_CS: length 22.5
  Top Layer w0.254: v1(22.22,30.47) 21.46,30.47 17.97,26.98 11.26,26.98
  Bottom Layer w0.254: v1(22.22,30.47) 22.48,30.47 23.24,31.23 25.53,31.23 25.91,31.62 25.91,32.25 26.4,32.74 RN1.3 27.7,32.74 29.38,31.07 30.31,31.07
SD_MOSI: length 22.3
  Top Layer w0.254: v1(18.03,37.08) 11.32,37.08 11.26,37.14
  Bottom Layer w0.254: v1(18.03,37.08) 24.89,37.08 26.03,35.93 26.03,33.9 26.4,33.54 RN1.2 27.92,33.54 29.34,32.12 30.26,32.12 30.31,32.17
SDA0: length 13.1
  Top Layer w0.254: 5.03,38.44 5.87,38.44 6.48,37.84 6.48,37.54 7.56,36.47 8.74,36.47 9.65,35.55 9.65,30.34 10.48,29.52 11.26,29.52
SDA1: length 32.4
  Top Layer w0.254: 43.05,34.69 43.05,35.36 ; 43.05,34.69 43.08,34.69 ; 43.05,34.69 v1(43.05,34.66) 43.08,34.69 ; 43.05,34.69 42.9,34.69 ; 43.08,34.69 U11.4 ; v1(35.05,41.78) 34.67,41.78 34.27,41.37 R2.1 ; 34.19,39.44 34.19,41.08 R2.1 ; R2.1 33.66,41.13 33.66,40.25 31.37,37.97 31.37,32.38 29.78,30.79 29.06,30.79
  Bottom Layer w0.254: v1(43.05,34.66) 43.05,40.63 42.29,41.39 35.43,41.39 v1(35.05,41.78)
SERVO0: length 13.8
  Top Layer w0.254: 11.26,24.44 10.35,24.44 9.27,25.52 v1(9.27,27.3)
  Bottom Layer w0.254: v1(9.27,27.3) 9.27,28.57 7.87,29.96 5.97,29.96 4.44,31.49 H2.8
SERVO1: length 4.3
  Top Layer w0.254: 11.26,33.39 v1(10.41,33.39)
  Bottom Layer w0.254: v1(10.41,33.39) 8.51,31.49 H2.7
SPEAKER_DATA: length 71.4
  Top Layer w0.254: v1(13.97,34.66) 12.57,34.66 12.51,34.6 11.29,34.6
  Bottom Layer w0.15: v1(13.97,34.66) 13.14,34.66 11.99,35.82 11.99,38.53 13.36,39.9 17.04,39.9 19.31,42.17 29.78,42.17 31.39,43.78 33.68,43.78 34.06,43.4 34.06,40.86 36.2,38.73 36.19,29.01 37.81,27.4 42.76,27.4 44.88,25.28 44.88,20.36 43.82,19.3 41.15,19.3 40.13,18.28 40.13,15.81 U19.4
SPEAKER_N: length 37.7
  Bottom Layer w0.254: U19.5 46.61,15.36 47.1,15.85 47.1,24.78 44.68,27.2 44.68,39.77 42.42,42.03 40.26,42.03 38.99,43.3 38.99,45.46 40.51,46.98
SPEAKER_P: length 37.5
  Bottom Layer w0.254: U19.8 46.86,11.55 47.5,12.19 47.5,25.01 45.09,27.42 45.09,40.12 42.77,42.44 41.76,42.44 40.51,43.68 40.51,44.44
TX0: length 31.4
  Top Layer w0.254: 29.06,37.14 28.51,37.14 25.15,33.77 v1(25.15,27.55) ; U14.9 32.37,17.53 31.87,18.03 31.87,27.55 v1(32.13,27.81)
  Bottom Layer w0.254: v1(32.13,27.81) 31.83,27.81 30.43,26.41 26.03,26.41 25.15,27.3 v1(25.15,27.55)
U0-I: length 27.1
  Top Layer w0.35: 15.14,5.73 15.14,5.58 v1(15.11,5.71) 15.14,5.73 ; 15.14,5.73 U3.5
  Bottom Layer w0.254: U5.2 20.58,16.83 18.98,18.43 15.96,18.43 14.76,17.23 14.76,15.45 13.93,14.62 13.17,14.62 11.86,13.32 11.86,9.21 12.67,8.4 12.67,7.44 13.67,6.44 13.97,6.44 14.71,5.71 v1(15.11,5.71)
  vias: v1(15.11,5.07) v1(15.11,4.44) v1(15.75,5.71) v1(15.75,5.07) v1(15.75,4.44)
U0-O: length 27.1
  Top Layer w0.254: v1(12.45,9.52) 11.3,8.37 v1(11.3,7.36)
  Bottom Layer w0.254: U5.3 20.65,16.18 18.8,18.03 16.23,18.03 15.16,16.96 15.16,15.28 14.1,14.22 13.34,14.22 12.45,13.33 v1(12.45,9.52) ; 11.86,5.07 11.86,6.04 11.3,6.6 v1(11.3,7.36)
  Bottom Layer w1: 11.43,1.8 11.43,4.64 11.86,5.07
U1-I: length 19.9
  Top Layer w0.254: v1(35.18,16.25) 36.13,16.25 37.43,14.95 37.47,14.98 v1(37.59,14.85)
  Top Layer w0.35: 33.36,7.92 33.36,7.14 arc(33.63,6.49) 34.29,6.22
  Bottom Layer w0.254: v1(35.18,16.25) 34.6,16.83 U8.2 ; 37.4,14.91 37.47,14.98 v1(37.59,14.85) 37.72,14.85 38.18,14.39 38.18,7.14 37,5.96 35.94,5.96 v1(35.18,5.2) 35.18,5.07
  vias: v1(34.54,5.83) v1(34.56,5.2) v1(34.54,4.56) v1(35.18,5.83) v1(35.18,4.56)
U1-O: length 22.2
  Bottom Layer w0.254: U8.3 34.23,16.18 34.92,15.49 37.97,15.49 38.58,14.88 38.58,6.05 38.3,5.77
  Bottom Layer w1: 38.3,5.2 38.3,2.86 37.08,1.64 H6.1
UD+: length 6.5
  Top Layer w0.2: U14.1 38.99,16.49 38.99,14.98 39.89,14.08 USBC1.B6 41.67,14.08 41.91,13.84 41.91,13.33 41.66,13.07 40.95,13.07 USBC1.A6
UD-: length 8.5
  Top Layer w0.2: USBC1.B7 40.25,12.58 40,12.82 40,13.33 40.25,13.58 ; 40.25,13.58 39.88,13.58 37.94,15.52 37.94,17.11 38.37,17.53 U14.2 ; 40.25,13.58 USBC1.A7
W0: length 8.3
  Top Layer w0.35: U3.8 17.09,5.89
  Bottom Layer w1: 17.27,5.71 17.27,4.06 16.51,3.29 14.86,3.29 13.97,2.41 H7.2
  vias: v1(16.89,5.71) v1(16.89,5.07) v1(16.89,4.44) v1(17.53,5.71) v1(17.53,5.07) v1(17.53,4.44)
W1: length 6.6
  Top Layer w0.35: U2.8 32.71,5.76 32.77,5.71 arc(32.77,5.68) 32.78,5.71
  Bottom Layer w1: H6.2 31.75,2.53 33.02,3.8 33.02,5.58
  vias: v1(32.7,5.71) v1(32.7,5.07) v1(32.7,4.44) v1(33.34,5.71) v1(33.34,5.07) v1(33.34,4.44)
$1N1352: length 4.8
  Top Layer w0.254: U2.17 U2.16 U2.15 37.78,13.53 38.48,12.82 C15.2
$1N1354: length 6.6
  Top Layer w0.254: U2.1 28.16,7.07 27.84,6.75 25.93,6.75 25.27,6.09 25.27,4.44 25.61,4.1 C16.2
$1N1355: length 4.3
  Top Layer w0.254: U2.2 28.81,6.83 28.32,6.34 26.87,6.34 C16.1
$1N1356: length 3.1
  Top Layer w0.254: 27.81,5.52 28.13,5.52 29.46,6.84 U2.3
$1N3339: length 5
  Top Layer w0.254: U3.17 U3.16 U3.15 22.28,13.53 22.99,12.82 C1.2
$1N3341: length 7.3
  Top Layer w0.254: 10.41,3.93 10.03,3.93 9.65,4.31 9.65,5.87 10.53,6.75 12.34,6.75 12.54,6.94 U3.1 ; 10.41,3.93 10.67,3.99 10.73,3.93 10.41,3.93
$1N3342: length 4.7
  Top Layer w0.254: U3.2 13.21,7.78 13.21,6.85 12.7,6.34 10.79,6.34 10.41,5.96 C2.1
$1N3343: length 2.7
  Top Layer w0.254: 13.84,7.8 13.84,6.84 12.57,5.58
$1N4664: length 5.5
  Top Layer w0.254: C9.2 39.88,38.92 39.88,39.87 39.5,40.25 36.45,40.25 36.2,40 36.2,39.44
$1N4673: length 3
  Top Layer w0.254: 35.18,35.48 35.18,34.16 34.29,33.27 R3.2
$1N9396: length 5
  Top Layer w0.254: Q4.1 43.48,23.49 43.94,23.49 44.32,23.87 44.32,26.4 44.31,26.41
$1N9397: length 4.9
  Top Layer w0.254: Q3.1 39.29,23.61 39.88,23.61 40.13,23.87 40.13,26.4 R9.1
$1N60106: length 2.7
  Top Layer w0.254: LED1.1 43.56,30.31 43.56,29.83 R12.2
$1N83130: length 4.7
  Top Layer w0.254: R13.1 39.62,7.73 v1(39.62,8.25)
  Bottom Layer w0.254: U19.1 39.62,10.59 v1(39.62,8.25)

## Copper pours and planes (outline as drawn; the poured copper is in the pictures)
GND on Top Layer: -0.13,49.14 49.02,49.14 49.02,-0.01 -0.13,-0.01
GND on Bottom Layer: 0.38,48.51 48.64,48.51 48.64,0.37 0.38,0.37
V0-I on Top Layer: 18.29,6.47 20.57,6.47 20.57,4.69 18.29,4.69
U0-I on Top Layer: 14.73,6.6 16.26,6.6 16.26,4.06 14.73,4.06
U1-I on Top Layer: 35.43,6.47 35.74,6.3 35.81,5.96 35.81,4.31 35.82,4.15 35.69,4.06 34.3,4.06 34.15,4.12 34.08,4.27 34.08,5.79 34.04,5.94 34.04,6.09 33.83,6.14 33.78,6.34 33.88,6.47 34.04,6.47
W1 on Top Layer: 32.38,6.09 32.3,6.05 32.26,5.96 32.26,4.18 32.3,4.09 32.38,4.06 33.02,4.06 33.34,4.08 33.66,4.18 33.66,5.83 33.35,6 33.02,6.09
V1-I on Top Layer: 30.63,6.21 30.43,6.13 30.35,5.93 30.35,4.31 30.43,4.13 30.61,4.06 31.5,4.06 31.77,4.17 31.88,4.44 31.88,6.09 31.84,6.18 31.75,6.22 30.64,6.22
VCC on Bottom Layer: 34.04,9.14 34.42,9.14 34.96,9.36 35.18,9.9 35.18,11.17 35.33,11.53 35.69,11.68 36.19,11.68 36.46,11.56 36.58,11.3 36.58,8.76 36.24,7.95 35.43,7.61 34.54,7.61 34.54,8.25 34.58,8.34 34.67,8.37 34.22,8.56 34.04,9.01
W0 on Top Layer: 16.89,6.22 16.62,6.1 16.51,5.83 16.51,4.31 16.62,4.04 16.89,3.93 17.4,3.93 17.72,4.03 17.91,4.31 17.93,5.96 17.77,6.15 17.53,6.22

## Text on the board
Bottom Silkscreen Layer: VCC | 请使用导线连接VCC
Top Silkscreen Layer: RST | EN
